# EAGLE design upconvertersch (EAGLE 9.6.2)
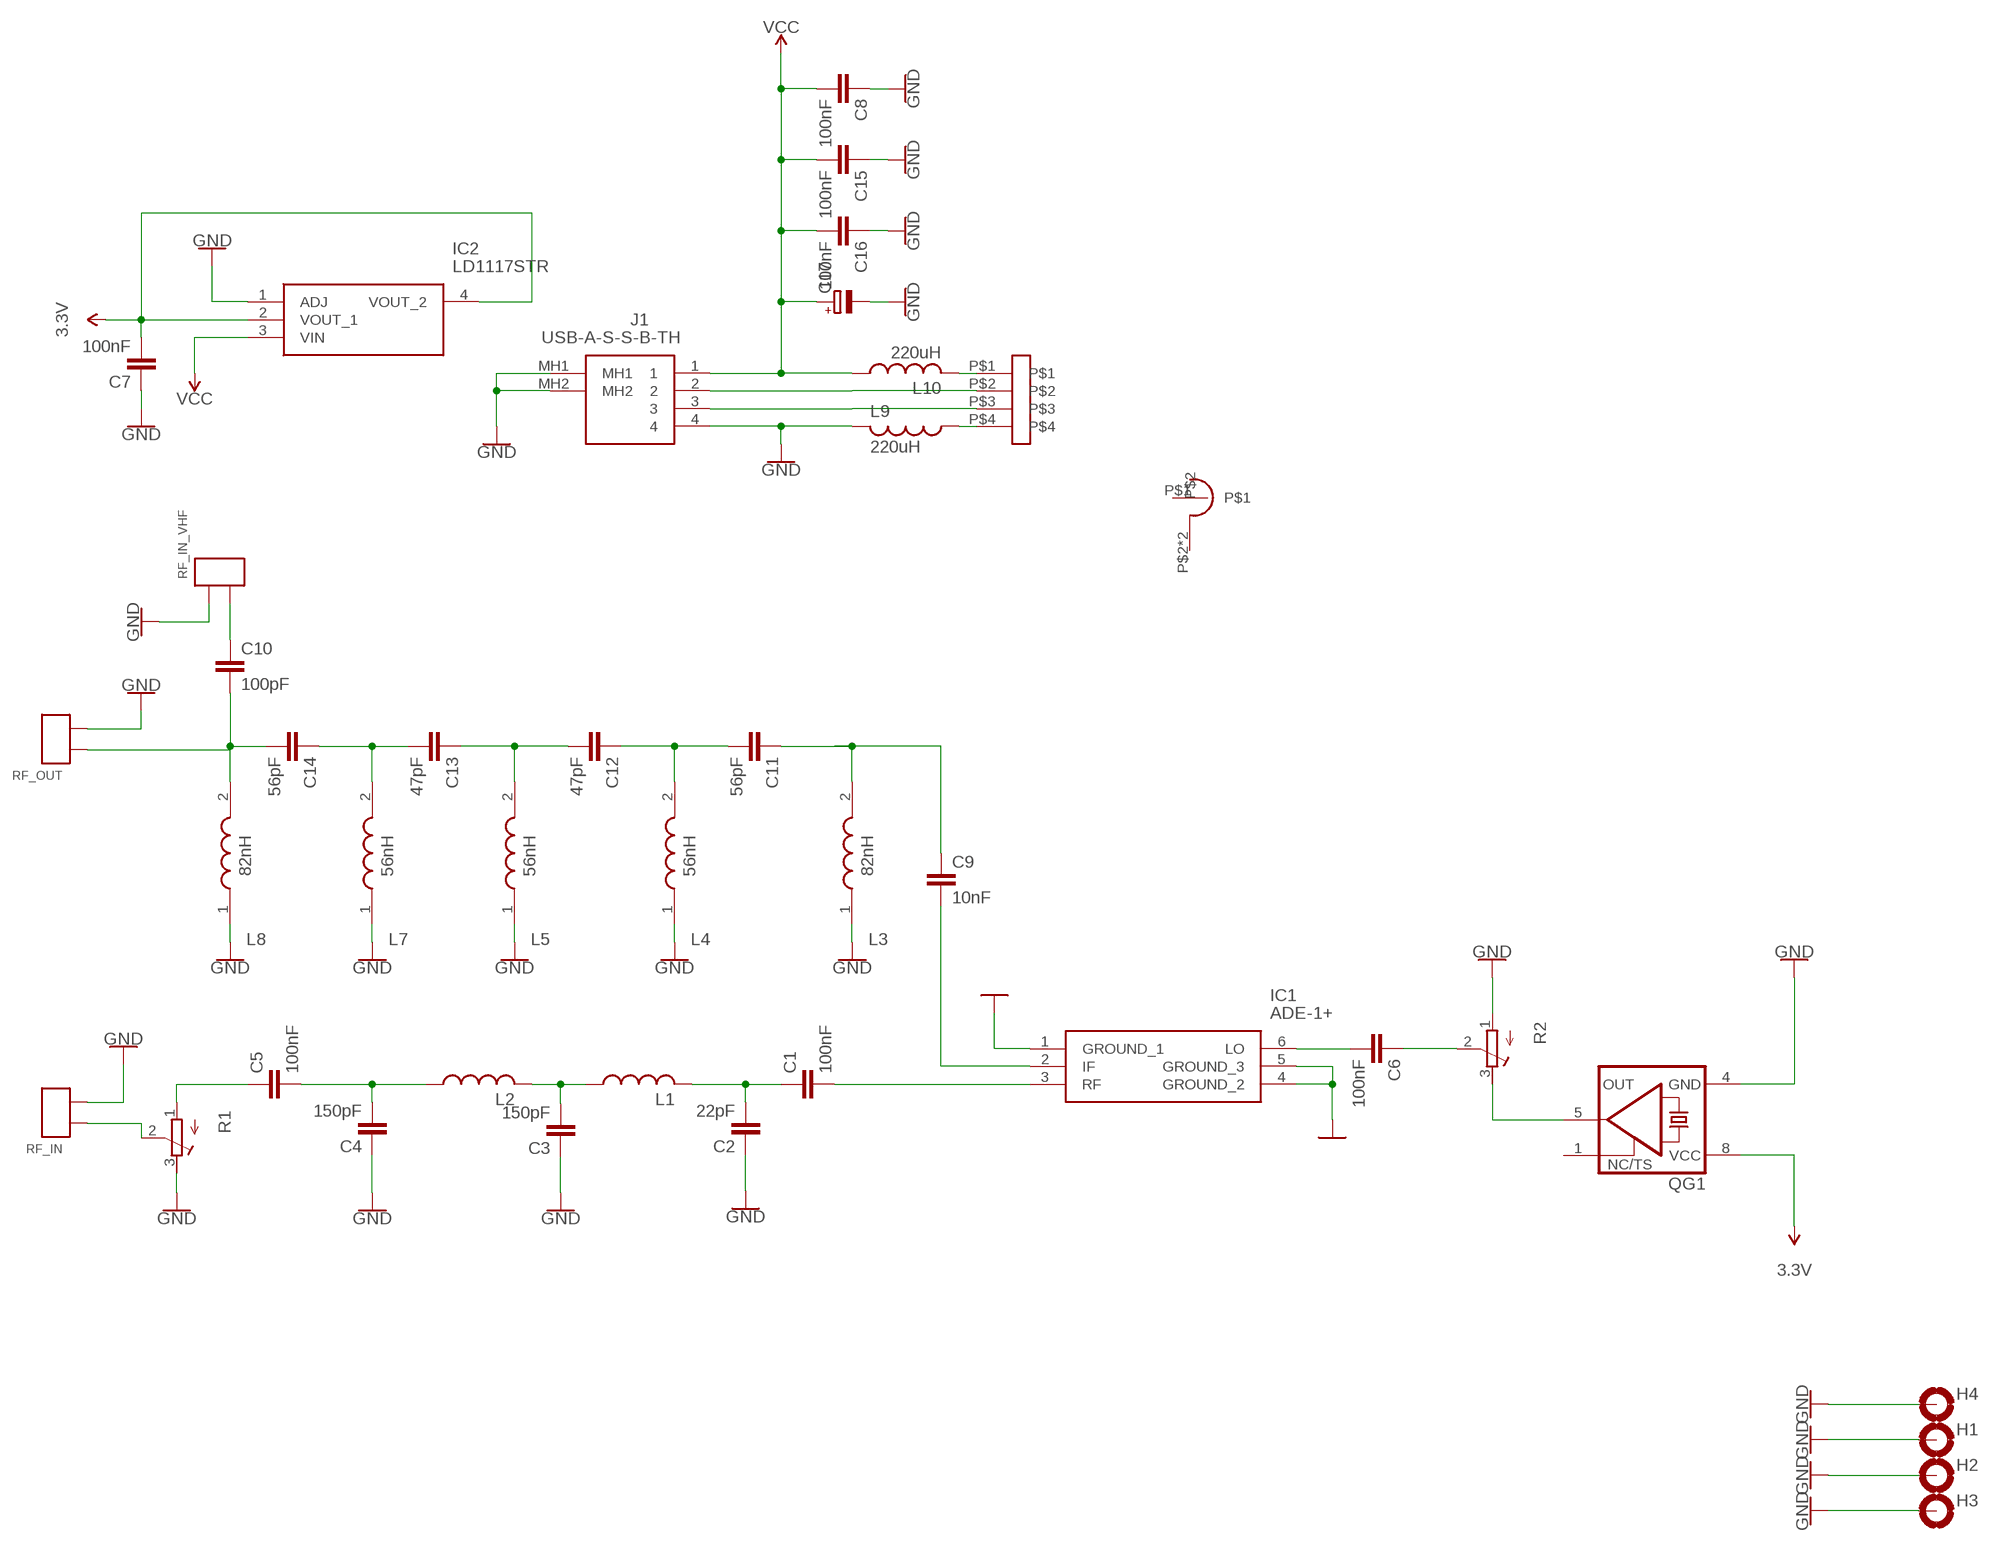
[diagram p0: schematic, sheet 1]

## Parts
C1  100nF  C_0805_PTH  [C0805K]
C2  22pF  C_0805_PTH  [C0805K]
C3  150pF  C_0805_PTH  [C0805K]
C4  150pF  C_0805_PTH  [C0805K]
C5  100nF  C_0805_PTH  [C0805K]
C6  100nF  C_0805_PTH  [C0805K]
C7  100nF  C_0805_PTH  [C0805K]
C8  100nF  C_0805_PTH  [C0805K]
C9  10nF  C_0805_PTH  [C0805K]
C10  100pF  C_0805_PTH  [C0805K]
C11  56pF  C_0805_PTH  [C0805K]
C12  47pF  C_0805_PTH  [C0805K]
C13  47pF  C_0805_PTH  [C0805K]
C14  56pF  C_0805_PTH  [C0805K]
C15  100nF  C_0805_PTH  [C0805K]
C16  100nF  C_0805_PTH  [C0805K]
C17  CPOL-EUE3.5-10  [E3,5-10]
H1  MOUNT-PAD-ROUND3.0  [3,0-PAD]
H2  MOUNT-PAD-ROUND3.0  [3,0-PAD]
H3  MOUNT-PAD-ROUND3.0  [3,0-PAD]
H4  MOUNT-PAD-ROUND3.0  [3,0-PAD]
IC1  ADE-1+  [ADE1]
IC2  LD1117STR  [SOT230P700X180-4N]
J1  USB-A-S-S-B-TH  [USBASSBTH]
JH1  4X_PIN_HEADER  [4X_PIN_HEADER]
L1  L_0805_PTH  [M0805]
L2  L_0805_PTH  [M0805]
L3  82nH  164-11A06L  [16411A06L]
L4  56nH  164-11A06L  [16411A06L]
L5  56nH  164-11A06L  [16411A06L]
L7  56nH  164-11A06L  [16411A06L]
L8  82nH  164-11A06L  [16411A06L]
L9  220uH  L_0805_PTH  [M0805]
L10  220uH  L_0805_PTH  [M0805]
QG1  XO-8  [DIL08S]
R1  R-TRIMM64W  [RTRIM64W]
R2  R-TRIMM64W  [RTRIM64W]
RF_IN  2X_SMD_PTH_PIN  [2X_SMD_PTH]
RF_IN_VHF  2X_SMD_PTH_PIN  [2X_SMD_PTH]
RF_OUT  2X_SMD_PTH_PIN  [2X_SMD_PTH]
U$1  RTL_SDR_CONN  [RTL_SDR_OUT]

## Nets
3.3V: C7.2 C7.P$2 IC2.2(VOUT_1) IC2.4(VOUT_2) QG1.8(VCC)
GND: C2.1 C2.P$1 C3.1 C3.P$1 C4.1 C4.P$1 C7.1 C7.P$1 C8.1 C8.P$1 C15.1 C15.P$1 C16.1 C16.P$1 C17.- H1.B3,0(MOUNT) H2.B3,0(MOUNT) H3.B3,0(MOUNT) H4.B3,0(MOUNT) IC1.1(GROUND_1) IC1.4(GROUND_2) IC1.5(GROUND_3) IC2.1(ADJ) J1.4 J1.MH1 J1.MH2 L3.1 L4.1 L5.1 L7.1 L8.1 L9.2 L9.P$2 QG1.4(GND) R1.3(E) R2.1(A) RF_IN.P$2(PIN1) RF_IN.T$2(PIN1) RF_IN_VHF.P$1(PIN0) RF_IN_VHF.T$1(PIN0) RF_OUT.P$2(PIN1) RF_OUT.T$2(PIN1)
N$1: C1.2 C1.P$2 IC1.3(RF)
N$2: C9.2 C9.P$2 IC1.2(IF)
N$3: C6.2 C6.P$2 IC1.6(LO)
N$4: J1.2 JH1.P$2
N$5: J1.3 JH1.P$3
N$6: C1.1 C1.P$1 C2.2 C2.P$2 L1.2 L1.P$2
N$7: C3.2 C3.P$2 L1.1 L1.P$1 L2.2 L2.P$2
N$8: C4.2 C4.P$2 C5.2 C5.P$2 L2.1 L2.P$1
N$9: C5.1 C5.P$1 R1.1(A)
N$10: R1.2(S) RF_IN.P$1(PIN0) RF_IN.T$1(PIN0)
N$11: QG1.5(OUT) R2.3(E)
N$12: C10.1 C10.P$1 RF_IN_VHF.P$2(PIN1) RF_IN_VHF.T$2(PIN1)
N$13: C6.1 C6.P$1 R2.2(S)
N$15: C9.1 C9.P$1 C11.1 C11.P$1 L3.2
N$16: C11.2 C11.P$2 C12.1 C12.P$1 L4.2
N$17: C12.2 C12.P$2 C13.1 C13.P$1 L5.2
N$18: C10.2 C10.P$2 C14.2 C14.P$2 L8.2 RF_OUT.P$1(PIN0) RF_OUT.T$1(PIN0)
N$19: C13.2 C13.P$2 C14.1 C14.P$1 L7.2
N$20: JH1.P$4 L9.1 L9.P$1
N$21: JH1.P$1 L10.2 L10.P$2
VCC: C8.2 C8.P$2 C15.2 C15.P$2 C16.2 C16.P$2 C17.+ IC2.3(VIN) J1.1 L10.1 L10.P$1
Unconnected: QG1.1(TS) U$1.P$1 U$1.P$2 U$1.P$3

## Library data of the parts
C1-C16 = mylib:C_0805_PTH
C17 = rcl:CPOL-EU: POLARIZED CAPACITOR, European symbol; SPICEPREFIX: C
H1-H4 = holes:MOUNT-PAD-ROUND: MOUNTING PAD, round
IC1 = ADE-1+:ADE-1+: RF Mixer Level 7, SMT Double Balanced Mixer, RF/LO Freq 0.5 - 500 MHz Source: Datasheet <https://componentsearchengine.com/Datasheets/1/ADE-1 .pdf>; DESCRIPTION: RF Mixer Level 7, SMT Double Balanced Mixer, RF/LO Freq 0.5 - 500 MHz; HEIGHT: 4.11mm; MANUFACTURER_NAME: Mini-Circuits; MANUFACTURER_PART_NUMBER: ADE-1+; MOUSER_PART_NUMBER: 139-ADE-1; MOUSER_PRICE-STOCK: https://www.mouser.co.uk/ProductDetail/Mini-Circuits/ADE-1%2b?qs=xZ%2FP%252Ba9zWqZNkkNe3uAsRQ%3D%3D
IC2 = LD1117STR:LD1117STR: LD1117STR, Low Dropout Voltage Regulator, Adjustable 1.3A, 1.25 15 V +/-1%, 4-Pin SOT-223 Source: Datasheet <http://www.st.com/st-web-ui/static/active/en/resource/technical/document/datasheet/CD00000544.pdf>; ARROW_PART_NUMBER: LD1117STR; ARROW_PRICE-STOCK: https://www.arrow.com/en/products/ld1117str/stmicroelectronics?region=nac; DESCRIPTION: LD1117STR, Low Dropout Voltage Regulator, Adjustable 1.3A, 1.25 15 V +/-1%, 4-Pin SOT-223; HEIGHT: 1.8mm; MANUFACTURER_NAME: STMicroelectronics; MANUFACTURER_PART_NUMBER: LD1117STR; MOUSER_PART_NUMBER: 511-LD1117S; MOUSER_PRICE-STOCK: https://www.mouser.co.uk/ProductDetail/STMicroelectronics/LD1117STR?qs=tZUCD5p2VWoh5188srwsAQ%3D%3D
J1 = USB-A-S-S-B-TH:USB-A-S-S-B-TH: Samtec USB-A Series, Right Angle Through Hole, Version 2.0 Type A USB Connector, Receptacle Source: Datasheet <http://suddendocs.samtec.com/prints/usb-a-s-x-x-th-x-mkt.pdf>; ARROW_PART_NUMBER: USB-A-S-S-B-TH; ARROW_PRICE-STOCK: https://www.arrow.com/en/products/usb-a-s-s-b-th/samtec; DESCRIPTION: Samtec USB-A Series, Right Angle Through Hole, Version 2.0 Type A USB Connector, Receptacle; HEIGHT: 7.21mm; MANUFACTURER_NAME: SAMTEC; MANUFACTURER_PART_NUMBER: USB-A-S-S-B-TH; MOUSER_PART_NUMBER: 200-USBASSBTH; MOUSER_PRICE-STOCK: https://www.mouser.co.uk/ProductDetail/Samtec/USB-A-S-S-B-TH?qs=rHlcMk0NooKirvKQP4B%2Fsg%3D%3D
JH1 = mylib:4X_PIN_HEADER
L1 L2 L9 L10 = mylib:L_0805_PTH
L3-L5 L7 L8 = 164-11A06L:164-11A06L: Variable Inductors 164 Unicoil Tunable 100 MHz 2.3 A Source: Datasheet <https://www.coilcraft.com/getmedia/31c16ea6-718f-435e-a089-e35fb15fb2b3/uni5.pdf>; DESCRIPTION: Variable Inductors 164 Unicoil Tunable 100 MHz 2.3 A; HEIGHT: 8.38mm; MANUFACTURER_NAME: COILCRAFT; MANUFACTURER_PART_NUMBER: 164-11A06L; MOUSER_PART_NUMBER: 994-164-11A06L; MOUSER_PRICE-STOCK: http://www.mouser.com/Search/ProductDetail.aspx?qs=ZYnrCdKdyefrm2fCOgXEUQ%3d%3d
QG1 = crystal:XO-: CRYSTAL; OC_FARNELL: unknown; OC_NEWARK: unknown
R1 R2 = rcl:R-TRIMM: Trimm resistor; SPICEMODEL: X; SPICEPREFIXL: POT
RF_IN RF_IN_VHF RF_OUT = mylib:2X_SMD_PTH_PIN
U$1 = mylib:RTL_SDR_CONN

## Board
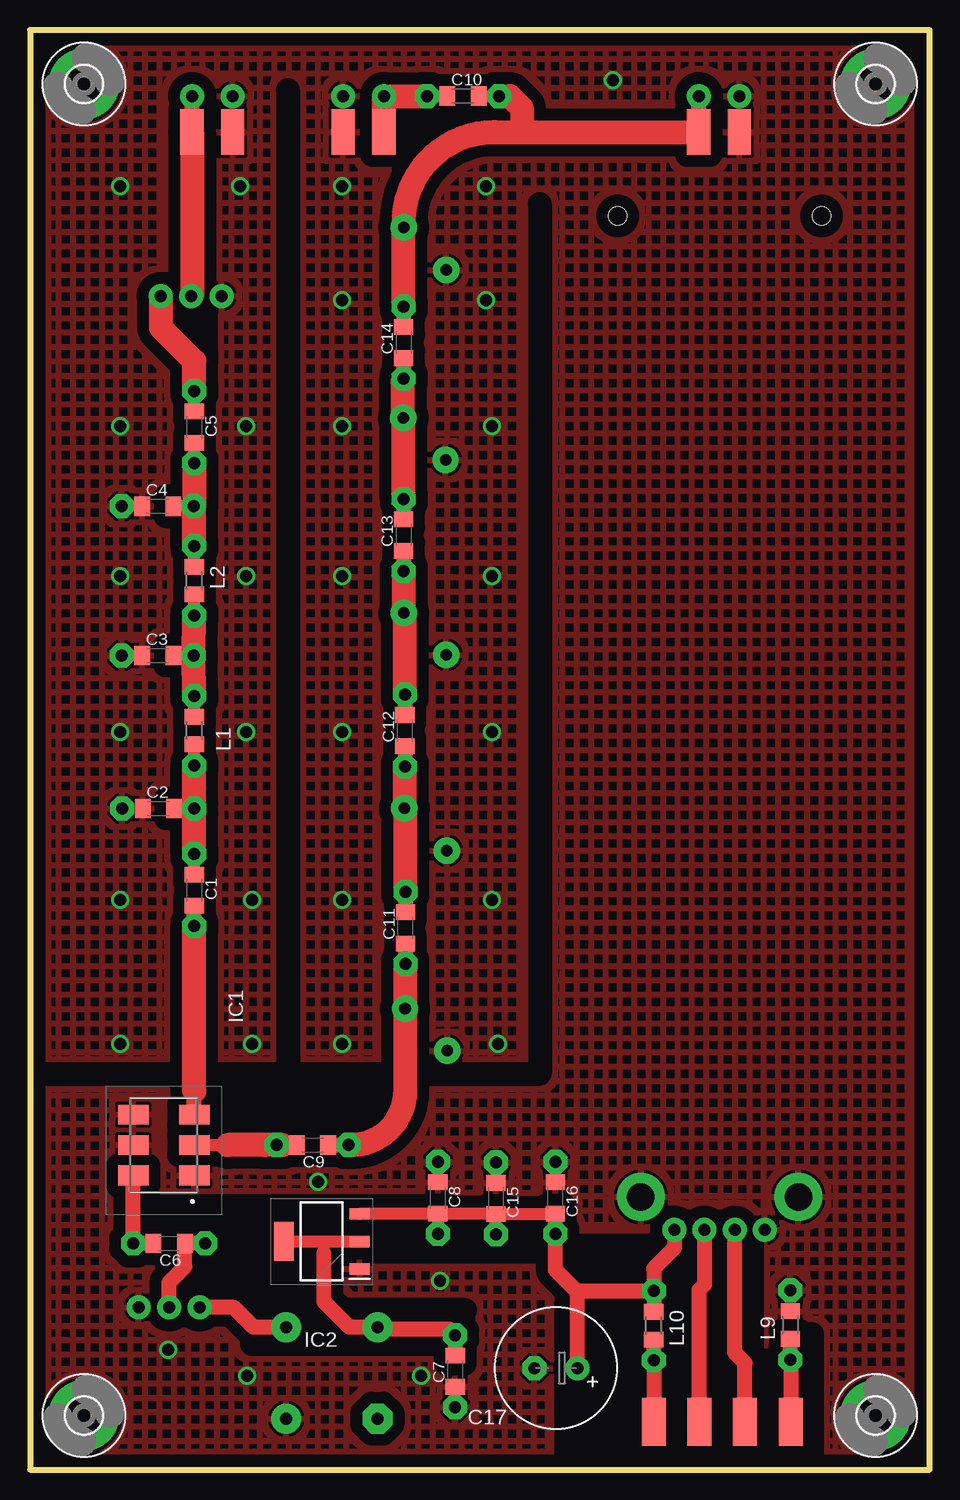
[diagram p1: board, top side]
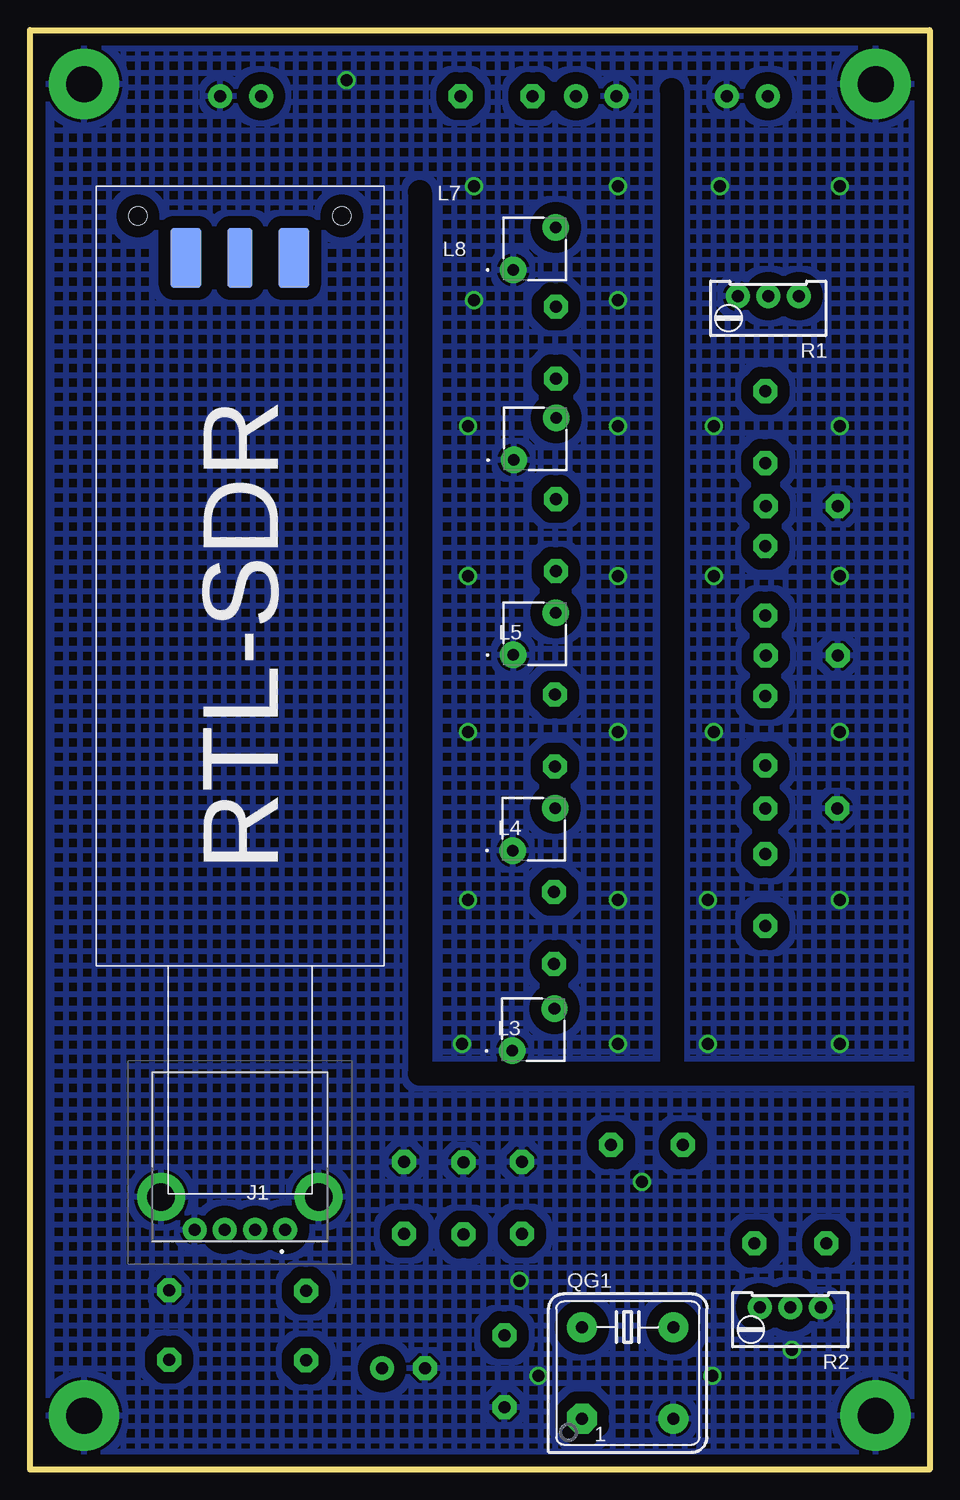
[diagram p2: board, bottom side, seen from below]

Size 75 x 120 mm. Coordinates in mm from the lower left corner, seen from the top.
Outline: 0,0 75,0 75,120 0,120 0,0
Copper layers (1*16): Top 0.035mm / dielectric 1.5mm / Bottom 0.035mm
Design rules "default": minimum track width 6mil, minimum drill 0.35mm, track to track 6mil, track to pad 6mil, pad to pad 6mil, via to via 6mil, smd to smd 6mil, copper to edge 40mil, drill to drill 6mil, minimum pad ring 10mil, minimum via ring 8mil, stop-mask expansion 4mil, vias tented up to drill 0mil, thermal gap 10mil
tRestrict: 15 lines
bRestrict: 3 lines

### Footprints (pad centres in the part's own frame; a part is rotated, then mirrored left to right if it is on the bottom)
C0805K = smd 1.3 x 1.6: 1 -1.3,0; 2 1.3,0 | drill 1 pad 2 octagon: P$1 -3,0; P$2 3,0
E3,5-10 = drill 1 pad 2: + -1.778,0 | drill 1 pad 2 octagon: - 1.778,0
3,0-PAD = drill 3 pad 5.842: B3,0 0,0
ADE1 = smd 1.65 x 2.54: 1 -2.54,-2.54; 2 0,-2.54; 3 2.54,-2.54; 4 2.54,2.54; 5 0,2.54; 6 -2.54,2.54
SOT230P700X180-4N = smd 1.65 x 0.95: 1 -3.15,2.3; 2 -3.15,0; 3 -3.15,-2.3 | smd 1.65 x 3.25: 4 3.15,0
USBASSBTH = drill 1 pad 2: 1 -0.254,0; 2 2.246,0; 3 4.754,0; 4 7.254,0 | drill 2.3 pad 4: MH1 -3.07,-2.71; MH2 10.07,-2.71
4X_PIN_HEADER = smd 2 x 4: P$1 0,0; P$2 3.81,0; P$3 7.62,0; P$4 11.43,0
M0805 = smd 1.3 x 1.6: 1 -1.15,0; 2 1.15,0 | drill 1 pad 2 octagon: P$1 -2.9,0; P$2 2.9,0
16411A06L = drill 0.965 pad 2.2: 1 0,0; 2 3.53,3.53
DIL08S = drill 1 pad 2.5 octagon: 1 -3.81,-3.81 | drill 1 pad 2.5: 4 3.81,-3.81; 5 3.81,3.81; 8 -3.81,3.81
RTRIM64W = drill 1 pad 2: 1 1.27,-2.54; 2 1.27,0; 3 1.27,2.54
2X_SMD_PTH = smd 3.81 x 1.93: P$1 0,1.7; P$2 0,-1.7 | drill 1 pad 2: T$1 3,1.7; T$2 3,-1.7
RTL_SDR_OUT = smd 2 x 5 bottom: P$1 12,-6 | smd 2.5 x 5 bottom: P$2 7.5,-6; P$3 16.5,-6 | hole 1.5: 3.5,-2.5; 20.5,-2.5

### Placement (x,y rotation side)
C1  13.7,48.3 270 top
C2  10.7,55.1 0 top
C3  10.65,67.85 0 top
C4  10.65,80.3 0 top
C5  13.7,86.9 270 top
C6  11.6,18.85 180 top
C7  35.45,8.2 90 top
C8  34,22.65 270 top
C9  23.55,27.05 180 top
C10  36.1,114.5 0 top
C11  31.3,45.15 90 top
C12  31.25,61.6 90 top
C13  31.15,77.9 90 top
C14  31.15,93.95 90 top
C15  38.85,22.6 270 top
C16  43.8,22.65 270 top
C17  43.85,8.45 180 top
H1  4.5,4.5 0 top
H2  70.5,4.5 0 top
H3  4.5,115.5 0 top
H4  70.5,115.5 0 top
IC1  11.15,27.05 90 top
IC2  24.32,19.01 180 top
J1  54,20 180 bottom
JH1  52,4 0 top
L1  13.7,61.6 270 top
L2  13.7,74.1 270 top
L3  34.8,34.9 0 bottom
L4  34.75,51.6 0 bottom
L5  34.7,67.9 0 bottom
L7  34.65,84.15 0 bottom
L8  34.7,100 0 bottom
L9  63.4,12.05 90 top
L10  52,12 270 top
QG1  25.15,8.05 0 bottom
R1  13.45,96.55 90 bottom
R2  11.6,12.25 90 bottom
RF_IN  15.2,111.5 90 top
RF_IN_VHF  27.8,111.5 90 top
RF_OUT  57.45,111.5 90 top
U$1  45.5,107 0 top

### Tracks (layer width: path | path; a pad name or v marks a point on that pad's centre or on a via)
3.3V
  Top 1.016: IC2.4 24.5,19.01 | 24.5,19.01 IC2.2 | 24.5,18 24.5,19.01
  Top 1.27: 24.5,18 24.5,14 26.64,11.86 QG1.8 28.8,11.7 34.95,11.7 C7.P$2 C7.2
GND  (via drill 1)
  other vias: 24,24 11.5,10 34.2,15.75 18.1,7.8 32.6,7.8 7.5,35.5 7.5,47.5 7.5,61.5 7.5,74.5 7.5,87 7.5,107 48.6,115.8 17.5,107 18,87 18,74.5 18,61.5 18.5,47.5 18.5,35.5 26,35.5 26,47.5 26,61.5 26,74.5 26,87 26,107 39,35.5 38.5,47.5 38.5,61.5 38.5,74.5 38.5,87 38,107 26,97.5 38,97.5
  pour Top (isolate 1, hatched): -1.5,122.5 -1.5,-2 77,-2 77,122.5
  pour Bottom (isolate 1, hatched): -2,123.5 -2,-3 79,-3 79,123.5
N$1
  Top 1.27: IC1.3 13.69,31.54 | C1.P$2 C1.2
  Top 2: 13.69,31.54 C1.P$2
N$2
  Top 1.016: IC1.2 16.5,27.05
  Top 1.27: C9.2 21.05,27.05
  Top 2: 21.05,27.05 C9.P$2 19.55,27.05 16.5,27.05
N$3
  Top 1.27: C6.2 C6.P$2 IC1.6
N$4
  Top 1.27: J1.2 56.25,15.44 55.81,15 JH1.P$2
N$5
  Top 1.27: JH1.P$3 59.62,8.88 58.75,9.75 J1.3
N$6
  Top 1.016: C1.1 C1.P$1 13.75,51.35 C2.P$2 C2.2 | L1.P$2 L1.2
  Top 2: C1.P$1 L1.P$2
N$7
  Top 1.016: L1.1 L1.P$1 | C3.P$2 C3.2 | L2.P$2 L2.2
  Top 2: L1.P$1 C3.P$2 L2.P$2
N$8
  Top 1.016: L2.1 L2.P$1 | C5.P$2 C5.2 | 13.7,80.35 C4.2 C4.P$2
  Top 2: L2.P$1 13.7,80.35 C5.P$2
N$9
  Top 1.016: C5.1 C5.P$1
  Top 2: R1.1 10.91,95.19 13.7,92.4 C5.P$1
N$10
  Top 1.27: RF_IN.P$1 RF_IN.T$1
  Top 2: R1.2 13.5,97.87 RF_IN.P$1
N$11
  Top 1.27: QG1.5 18.64,11.86 16.98,13.52 R2.3
N$12
  Top 1.016: C10.P$1 C10.1
  Top 2: RF_IN_VHF.P$2 RF_IN_VHF.T$2 C10.P$1
N$13
  Top 1.27: C6.P$1 C6.1 12.9,16.9 11.6,15.6 R2.2
N$15
  Top 1.27: C11.1 C11.P$1 | C9.1 C9.P$1
  Top 2: L3.2 arc90 31.3,38.46 | 31.3,38.46 C11.P$1 | C9.P$1 26.76,27.05 arc90 31.3,31.59 31.3,38.46
N$16
  Top 1.27: C12.1 C12.P$1 | C11.P$2 C11.2
  Top 2: C11.P$2 31.3,55.05 arc90 L4.2 arc90 31.25,55.16 C12.P$1
N$17
  Top 1.27: C13.1 C13.P$1 arc90 31.17,74.88 | C12.P$2 C12.2
  Top 2: C12.P$2 31.25,71.35 arc90 L5.2 31.17,74.88 arc90 C13.P$1
N$18
  Top 1.016: C10.2 C10.P$2
  Top 1.27: C14.P$2 C14.2 | RF_OUT.P$1 RF_OUT.T$1
  Top 2: C14.P$2 31.15,103.51 arc-90 L8.2 31.17,103.96 arc-90 38.71,111.5 41,111.5 | 41,111.5 RF_OUT.P$1 | C10.P$2 40,114.5 41,113.5 41,111.5
N$19
  Top 1.27: C14.1 C14.P$1 arc-90 31.12,90.92 | C13.P$2 C13.2
  Top 2: C13.P$2 31.15,87.65 arc90 L7.2 31.12,90.92 arc-90 C14.P$1
N$20
  Top 1.27: JH1.P$4 63.43,9.12 L9.P$1 L9.1
N$21
  Top 1.27: JH1.P$1 L10.P$2 L10.2
VCC
  Top 1.016: C8.2 33.96,21.31 IC2.3 | C8.2 38.8,21.35 | 38.8,21.35 C15.2 43.75,21.3 C16.2 | C8.2 C8.P$2 | C15.P$2 38.8,19.65 38.8,21.35
  Top 1.27: J1.1 53.75,18.5 52,16.75 L10.P$1 | L10.P$1 L10.1 | 45.55,14.9 43.8,16.65 C16.P$2 43.8,21.25 43.75,21.3 | 45.55,14.9 L10.P$1 | C17.+ 45.63,14.82 45.55,14.9